# Altium schematic sheet BMS_BoardHardware_V1.SchDoc
size A4
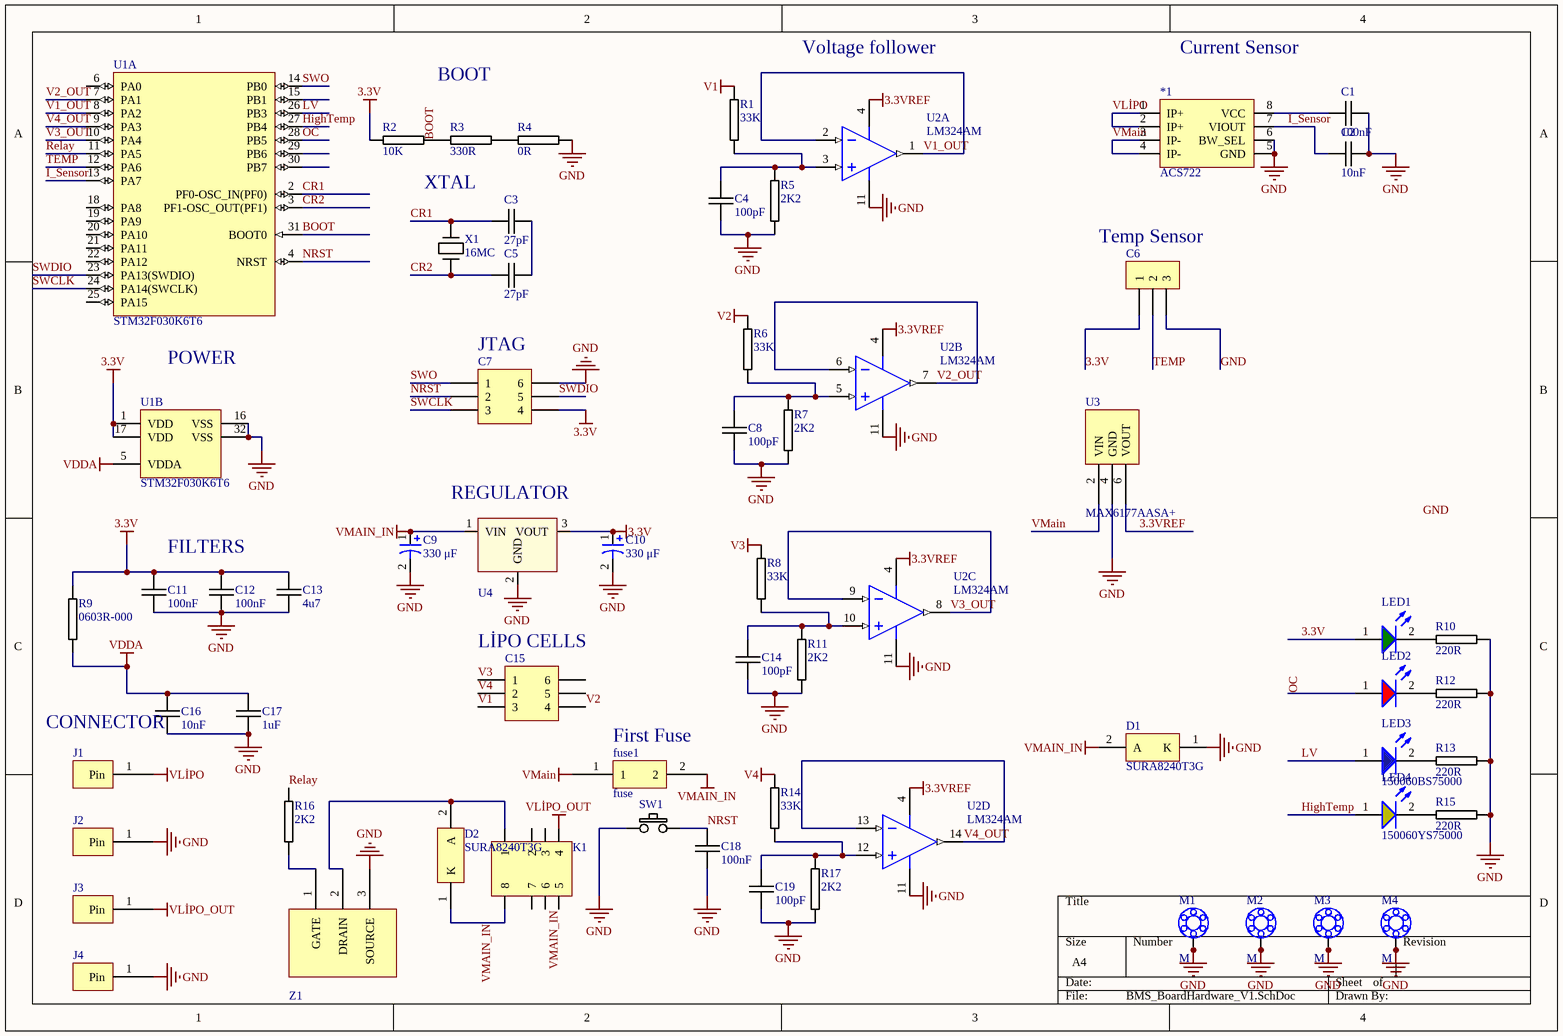
[diagram p0: BMS_BoardHardware_V1.SchDoc]

## Parts
*1  ACS722  [PCBComponent_1]
C1  100nF  [0603C-GENERIC]
C2  10nF  [0603C-GENERIC]
C3  27pF  [0603C-GENERIC]
C4  100pF  [0603C-GENERIC]
C5  27pF  [0603C-GENERIC]
C6  (no value)  [66200311122]
C7  (no value)  [66200621022]
C8  100pF  [0603C-GENERIC]
C9  330 μF  [WCAP-PSLP 6.3x5.8x2.2]
C10  330 μF  [WCAP-PSLP 6.3x5.8x2.2]
C11  100nF  [0603C-GENERIC]
C12  100nF  [0603C-GENERIC]
C13  4u7  [0603C-GENERIC]
C14  100pF  [0603C-GENERIC]
C15  (no value)  [66200621022]
C16  10nF  [0603C-GENERIC]
C17  1uF  [0603C-GENERIC]
C18  100nF  [0603C-GENERIC]
C19  100pF  [0603C-GENERIC]
D1  SURA8240T3G  [ONSC-SMA-2-403D-02_V]
D2  SURA8240T3G  [ONSC-SMA-2-403D-02_V]
fuse1  fuse  [fuse]
J1  (no value)  [74722015]
J2  (no value)  [74722015]
J3  (no value)  [74722015]
J4  (no value)  [74722015]
K1  (no value)  [RELAY]
LED1  (no value)  [LED_0603_Green]
LED2  (no value)  [LED_0603_Red]
LED3  150060BS75000  [LED_0603_Blue]
LED4  150060YS75000  [LED_0603_Yellow]
M1  M  [MOUNTING]  (no BOM)
M2  M  [MOUNTING]  (no BOM)
M3  M  [MOUNTING]  (no BOM)
M4  M  [MOUNTING]  (no BOM)
R1  33K  [0603R-33K]
R2  10K  [0603R-10K]
R3  330R  [0603R-330]
R4  0R  [0603R-0R]
R5  2K2  [0603R-2K2]
R6  33K  [0603R-33K]
R7  2K2  [0603R-2K2]
R8  33K  [0603R-33K]
R9  0603R-000  [0603R-GENERIC]
R10  220R  [0603R-220]
R11  2K2  [0603R-2K2]
R12  220R  [0603R-220]
R13  220R  [0603R-220]
R14  33K  [0603R-33K]
R15  220R  [0603R-220]
R16  2K2  [0603R-2K2]
R17  2K2  [0603R-2K2]
SW1  (no value)  [SW-PB-SMD]
U1  STM32F030K6T6  [STM-LQFP32_N]  (parts A,B of 2)
U2  LM324AM  [M14A_N]  (parts A,B,C,D of 4)
U3  MAX6177AASA+  [MAX6177AASA+]
U4  3.3V  [WE-FDSM]  (value not drawn)
X1  16MC  [XTAL-RU49/4]
Z1  Mosfet  [NXP-SOT89_A_M]  (value not drawn)

## Nets
3.3V: C6.1 C7.4 C10.1 C11.1 C12.1 C13.1 LED1.1(A) R2.1 R9.2 U1.1(VDD) U1.17(VDD) U4.3(VOUT)
3.3VREF: U2.4(V+) U3.6(VOUT)
GND: *1.5(GND) *1.6(BW_SEL) C1.2 C2.2 C4.2 C6.3 C7.6 C8.2 C9.2 C10.2 C11.2 C12.2 C13.2 C14.2 C16.2 C17.2 C18.2 C19.2 D1.1(K) J2.1(Pin) J4.1(Pin) M1.1 M1.2 M1.3 M1.4 M1.5 M1.6 M1.7 M2.1 M2.2 M2.3 M2.4 M2.5 M2.6 M2.7 M3.1 M3.2 M3.3 M3.4 M3.5 M3.6 M3.7 M4.1 M4.2 M4.3 M4.4 M4.5 M4.6 M4.7 R4.2 R5.1 R7.1 R10.2 R11.1 R12.2 R13.2 R15.2 R17.1 SW1.1 U1.16(VSS) U1.32(VSS) U2.11(GND) U3.4(GND) U4.2(GND) Z1.3(SOURCE)
V1: C15.3 R1.1
V2: C15.4 R6.1
V3: C15.1 R8.1
V4: C15.2 R14.1
VDDA: C16.1 C17.1 R9.1 U1.5(VDDA)
VLİPO: *1.1(IP+) *1.2(IP+) J1.1(Pin)
VLİPO_OUT: J3.1(Pin) K1.4
VMain: *1.3(IP-) *1.4(IP-) fuse1.1 U3.2(VIN)
VMAIN_IN: C9.1 D1.2(A) D2.1(K) fuse1.2 K1.6 K1.8 U4.1(VIN)
BOOT: R2.2 R3.1 U1.31(BOOT0)
CR1: C3.1 U1.2(PF0-OSC_IN(PF0)) X1.1
CR2: C5.1 U1.3(PF1-OSC_OUT(PF1)) X1.2
HighTemp: LED4.1(A) U1.27(PB4)
I_Sensor: *1.7(VIOUT) C2.1 U1.13(PA7)
LV: LED3.1(A) U1.26(PB3)
NRST: C7.2 C18.1 SW1.2 U1.4(NRST)
OC: LED2.1(A) U1.28(PB5)
Relay: R16.1 U1.11(PA5)
SWCLK: C7.3 U1.24(PA14(SWCLK))
SWDIO: C7.5 U1.23(PA13(SWDIO))
SWO: C7.1 U1.14(PB0)
TEMP: C6.2 U1.12(PA6)
V1_OUT: U1.8(PA2) U2.1(OUT1) U2.2(IN1-)
V2_OUT: U1.7(PA1) U2.6(IN2-) U2.7(OUT2)
V3_OUT: U1.10(PA4) U2.8(OUT3) U2.9(IN3-)
V4_OUT: U1.9(PA3) U2.13(IN4-) U2.14(OUT4)
Net*1_8: *1.8(VCC) C1.1
NetC3_2: C3.2 C5.2
NetC4_1: C4.1 R1.2 R5.2 U2.3(IN1+)
NetC8_1: C8.1 R6.2 R7.2 U2.5(IN2+)
NetC14_1: C14.1 R8.2 R11.2 U2.10(IN3+)
NetC19_1: C19.1 R14.2 R17.2 U2.12(IN4+)
NetD2_2: D2.2(A) K1.1 Z1.2(DRAIN)
NetLED1_2: LED1.2(C) R10.1
NetLED2_2: LED2.2(C) R12.1
NetLED3_2: LED3.2(C) R13.1
NetLED4_2: LED4.2(C) R15.1
NetR3_2: R3.2 R4.1
NetR16_2: R16.2 Z1.1(GATE)

Not connected (* = marked no-connect by the designer): C15 5 6; K1 2 3 5 7; U1 6(PA0) 15(PB1) 18(PA8) 19(PA9) 20(PA10) 21(PA11) 22(PA12) 25(PA15) 29(PB6) 30(PB7)

## Notes on the sheet
- BOOT
- Voltage follower
- Current Sensor
- XTAL
- (near C6) Temp Sensor
- (near U1) POWER
- (near C7) JTAG
- (near U4) REGULATOR
- FILTERS
- (near C15) LİPO CELLS
- CONNECTOR
- (near fuse1) First Fuse
- Labels drawn without touching a wire or pin: GND

## Library data of the parts
C1 C11 C12 = 0603C-100NF-25V-X7R-TDK: CAPACITOR 0603 CERAMIC; Manufacturer Part Number: C1608X7R1E104K; Manufacturer: TDK Corporation; Reel: C12; Supplier 1: Digi-Key; Supplier Part Number 1: 445-1316-2-ND
C2 C16 = 0603C-10NF-50V-X7R-MUR: CAPACITOR 0603 CERAMIC; Manufacturer Part Number: GRM188R71H103KA01D; Manufacturer: Murata Electronics North America; Reel: C22; Supplier 1: Digi-Key; Supplier Part Number 1: 490-1512-2-ND
C3 C5 = 0603C-27pF: CAPACITOR 0603 CERAMIC; REEL: C98; Supplier 1: Digi-Key; Supplier Part Number 1: 445-1274-2-ND
C4 C8 C14 C19 = 0603C-100PF-50V-NP0-AVX: CAPACITOR 0603 CERAMIC; Reel: C44
C6 = WE-3.00 mm Micro Power Connector 66200311122: WR-MPC3 3.00 mm Male Single Row Vertical Header; Manufacturer: W¨¹rth Elektronik eiSos GmbH; ComponentLink1 Description: Manufacturer; ComponentLink2 Description: Datasheet; NoPins: 03; Created Date: 27 August 2013; partNo: 66200311122; ComponentLink1URL: http://www.we-online.com; ComponentLink2URL: http://katalog.we-online.de/em/datasheet/6620xx11122.pdf; Created by: Karrer Zheng
C7 C15 = WE-3.00 mm Micro Power Connector 66200621022: WR-MPC3 3.00 mm Male Dual Row Angled Header with Plastic Pegs; Manufacturer: W¨¹rth Elektronik eiSos GmbH; ComponentLink1 Description: Manufacturer; ComponentLink2 Description: Datasheet; NoPins: 06; Created Date: 20 August 2013; partNo: 66200621022; ComponentLink1URL: http://www.we-online.com; ComponentLink2URL: http://katalog.we-online.de/em/datasheet/6620xx21022.pdf; Created by: Karrer Zheng
C9 C10 = WCAP-PSLP 6.3x5.8x2.2 875105144010: WCAP-PSLP Aluminum Polymer Capacitors , 330 μF; + / - 20%; 6,3 V , 6,3 x 5,8; Manufacturer: Wurth Elektronik; E-mail: libraries@we-online.com; Characteristics: Aluminum Polymer Capacitors;Recommended soldering: Reflow;Operating temperature: –55 °C to +105 °C;Low profile SMD product series;Low ESR at high frequency range;High permissible ripple current;Load life: 2000 h @ +105 °C; ComponentLink1Description: Manufacturer; ComponentLink1URL: http://www.we-online.com; ComponentLink2Description: Datasheet; ComponentLink2URL: http://katalog.we-online.de/pbs/datasheet/875105144010.pdf; Created by: Karrer Zheng; Created Date: 5/13/2015; Capacitance: 330 μF; Application: Low voltage port filtering, appplid to high-end switching power supply, PC(desktop,laptop ),industrial computer, VGA card, server power, charger, TV, digital set-top box,DC-DC power module, game machine etc which consume large current with high speed circuit.; partNo: 875105144010
C13 = 0603C-4U7-6V3-X5R-KEM: CAPACITOR 0603 CERAMIC; Reel: C36
C17 = 0603C-1UF-10V-X5R-TDK: CAPACITOR 0603 CERAMIC; Manufacturer: TDK Corporation; Manufacturer Part Number: C1608X5R1A105K; Reel: C23; Supplier 1: Digi-Key; Supplier Part Number 1: 445-1321-2-ND
C18 = 0603C-100NF-50V-X7R-TDK: CAPACITOR 0603 CERAMIC; Manufacturer Part Number: C1608X7R1H103K; Manufacturer: TDK Corporation; Temperature Coefficient: X7R; Tolerance: ±10%; Voltage - Rated: 50V; Capacitance: 10000pF; Reel: C68; RoHS: RoHS Compliant; Lead Spacing: -; Package / Case: 0603 (1608 metric); Features: General Purpose; Packaging: Tape & Reel (TR); Thickness: 0.80mm; Operating Temperature: -55°C ~ 125°C; Mounting Type: Surface Mount, MLCC; Category: Capacitors; Supplier 1: Digi-Key; Supplier Part Number 1: 445-1314-2-ND
D1 D2 = SURA8240T3G: Surface Mount Ultrafast Power Rectifier, 2-Pin SMA, Pb-Free, Tape and Reel; Manufacturer: On Semiconductor; IFSM Max (A): 35; DatasheetVersion: Rev. 4; PackageVersion: Rev. G, 07/2012; PackageReference: SMA-2-403D-02; PackageDescription: 2-Pin Small Molded Package, J-Bend Lead, Body 2.605 x 4.315 mm; Supplier 1: Digi-Key; Supplier Part Number 1: SURA8240T3G-ND; Supplier 2: Mouser; Supplier Part Number 2: 863-SURA8240T3G; Packing: Tape and Reel; RoHS: TRUE; Type: Ultrafast; Mounting Technology: Surface Mount; PartNumber: SURA8240T3G; ComponentLink1Description: Manufacturer URL; ComponentLink1URL: http://www.onsemi.com/; ComponentLink2Description: Datasheet; ComponentLink2URL: http://www.onsemi.cn/pub_link/Collateral/MURA230T3-D.PDF; ComponentLink3Description: Package Specification; ComponentLink3URL: http://www.onsemi.com/pub_link/Collateral/403D-02.PDF
J1-J4 = 74722015
K1 = G2RL-1A-12V
LED1 = WL-SMCW 0603  150060GS75000: SMD mono-color Chip LED, WL-SMCW, Green; Manufacturer: W黵th Elektronik eiSos GmbH; PartNo: 150060GS75000; ComponentLink1Description: Manufacturer; ComponentLink1URL: http://www.we-online.de; Created by: Christin Otto; Created Date: June 2013; ComponentLink2Description: Datasheet; ComponentLink2URL: http://katalog.we-online.com/led/datasheet/150060GS75000.pdf; Color: Green
LED2 = WL-SMCW 0603  150060RS75000: SMD mono-color Chip LED, WL-SMCW, Red; Manufacturer: W黵th Elektronik eiSos GmbH; PartNo: 150060RS75000; ComponentLink1Description: Manufacturer; ComponentLink1URL: http://www.we-online.de; Created by: Christin Otto; Created Date: June 2013; ComponentLink2Description: Datasheet; ComponentLink2URL: http://katalog.we-online.com/led/datasheet/150060RS75000.pdf; Color: Red
LED3 = WL-SMCW 0603  150060BS75000: SMD mono-color Chip LED, WL-SMCW, Blue; Manufacturer: W黵th Elektronik eiSos GmbH; PartNo: 150060BS75000; ComponentLink1Description: Manufacturer; ComponentLink1URL: http://www.we-online.de; Created by: Christin Otto; Created Date: June 2013; ComponentLink2Description: Datasheet; ComponentLink2URL: http://katalog.we-online.com/led/datasheet/150060BS75000.pdf; Color: Blue
LED4 = WL-SMCW 0603  150060YS75000: SMD mono-color Chip LED, WL-SMCW, Yellow; Manufacturer: W黵th Elektronik eiSos GmbH; PartNo: 150060YS75000; ComponentLink1Description: Manufacturer; ComponentLink1URL: http://www.we-online.de; Created by: Christin Otto; Created Date: June 2013; ComponentLink2Description: Datasheet; ComponentLink2URL: http://katalog.we-online.com/led/datasheet/150060YS75000.pdf; Color: Yellow
M1-M4 = MOUNTING: MOUNTING HOLE - NON INSTALLABLE
R1 R6 R8 R14 = 0603R-33K: GENERIC RESISTOR 0603; Manufacturer Part Number: RMC 1/16 33K 1% G; Manufacturer: Stackpole Electronics Inc; Temperature Coefficient: ±100ppm/°C; Resistance In Ohms: 33.0K; Tolerance: ±1%; Power (Watts): 0.1W, 1/10W; Supplier 1: Digi-Key; Supplier Part Number 1: RMC1/1633KFG-ND; Supplier Part Number: RMC1/1633KFG-ND; Lead Style: Surface Mount (SMD - SMT); Case: 0603 (1608 metric); RoHS: RoHS Compliant; Supplier: Digi-Key; Composition: Thick Film; Packaging: Tape & Reel (TR); Category: Resistors
R2 = 0603R-10K: GENERIC RESISTOR 0603; Manufacturer: Stackpole Electronics Inc; Manufacturer Part Number: RMCF 1/16 10K 1% R; Tolerance: ±1%; Power (Watts): 0.1W, 1/10W; Temperature Coefficient: ±100ppm/°C; Resistance In Ohms: 10.0K; Reel: R21; Category: Resistors; Supplier Part Number: RMCF1/1610KFRDKR-ND; Lead Style: Surface Mount (SMD - SMT); RoHS: RoHS Compliant; Packaging: Digi-Reel®; Case: 0603 (1608 metric); Composition: Thick Film; Supplier: Digi-Key; Supplier 1: Digi-Key; Supplier Part Number 1: RMCF0603FT10K0DKR-ND
R3 = 0603R-330: GENERIC RESISTOR 0603; Manufacturer Part Number: RMCF 1/16 330 1% R; Manufacturer: Stackpole Electronics Inc; Power (Watts): 0.1W, 1/10W; Tolerance: ±1%; Resistance In Ohms: 330; Temperature Coefficient: ±100ppm/°C; Supplier 1: Digi-Key; Supplier Part Number 1: RMCF1/16330FRCT-ND; RoHS: RoHS Compliant; Packaging: Cut Tape (CT); Supplier: Digi-Key; Case: 0603 (1608 metric); Lead Style: Surface Mount (SMD - SMT); Supplier Part Number: RMCF1/16330FRCT-ND; Composition: Thick Film; Category: Resistors
R4 = 0603R-0R: GENERIC JUMPER 0603; Manufacturer: Stackpole Electronics Inc; Manufacturer Part Number: RMC 1/16 0 G; Reel: R26; Supplier 1: Digi-Key; Supplier Part Number 1: RMCF0603ZT0R00TR-ND
R5 R7 R11 R16 R17 = 0603R-2K2: GENERIC RESISTOR 0603; Manufacturer Part Number: RMC 1/16 2.2K 1% R; Manufacturer: Stackpole Electronics Inc; REEL: R88; Supplier 1: Digi-Key; Supplier Part Number 1: RMCF0603FT2K20TR-ND
R9 = 0603R-000: GENERIC RESISTOR 0603
R10 R12 R13 R15 = 0603R-220: GENERIC RESISTOR 0603; Manufacturer: Stackpole Electronics Inc; Manufacturer Part Number: RMCF 1/16 220 1% R; Resistance In Ohms: 220; Power (Watts): 0.1W, 1/10W; Tolerance: ±1%; Temperature Coefficient: ±100ppm/°C; Supplier 1: Digi-Key; Supplier Part Number 1: RMCF1/16220FRCT-ND; Lead Style: Surface Mount (SMD - SMT); Case: 0603 (1608 metric); RoHS: RoHS Compliant; Supplier: Digi-Key; Packaging: Cut Tape (CT); Composition: Thick Film; Supplier Part Number: RMCF1/16220FRCT-ND; Category: Resistors
SW1 = SW-PB-BLACK-SMD: PUSHBUTTON SWITCH 6MM SMD
U1 = STM32F030K6T6: ARM Cortex-M0 32-bit MCU, 32 KB Flash, 4 KB Internal RAM, 26 I/Os, 32-pin LQFP, -40 to 85 degC, Tray; FLASH Size (Prog) (kB): 32; I/Os (High Current): 26; Internal RAM Size (kB): 4; Operating Frequency(F) (Processor speed) (MHz): 48; Supply Voltage(Vcc) min (V): 2.4; DatasheetVersion: Rev. 1; PackageVersion: Rev. 1, 07/2013; PackageReference: LQFP32; PackageDescription: 32-Pin Low Profile Quad Flat Package, 7 x 7 mm Body, 0.8 mm Pitch; Supplier 1: Digi-Key; Supplier Part Number 1: 497-14046-ND; Supplier 2: Newark; Supplier Part Number 2: 19X6194; Supplier 3: Mouser; Supplier Part Number 3: 511-STM32F030K6T6; Core: ARM Cortex-M0; Packing: Tray; Mounting Technology: Surface Mount; PartNumber: STM32F030K6T6; ComponentLink1Description: Manufacturer URL; ComponentLink1URL: http://www.st.com/web/en/home.html; ComponentLink2Description: Datasheet; ComponentLink2URL: http://www.st.com/st-web-ui/static/active/en/resource/technical/document/datasheet/DM00088500.pdf; ComponentLink3Description: Package Specification; ComponentLink3URL: http://www.st.com/st-web-ui/static/active/en/resource/technical/document/datasheet/DM00088500.pdf
U2 = LM324AM: Low Power Quad Operational Amplifier, 14-pin Narrow SOIC; Manufacturer: National Semiconductor; PackageTopMarking: NSUZXYTTE#*LM324AM; PowerWise: N; CompType: Amplifiers; High-Reliability: Y; DatasheetVersion: Aug-2000; PackageVersion: revJ, Jan-1996; PackageReference: M14A; PackageDescription: Molded Package S.O., .150in Wide, 14 Lead; PartNumber: LM324AM; RoHS: N; PinCount: 14; Code_JEDEC: MS-012AB; Code_IPC: SOIC127P600-14; ComponentLink1Description: Manufacturer URL; ComponentLink1URL: http://www.national.com/; ComponentLink2Description: LM324 Datasheet; ComponentLink2URL: http://www.national.com/ds/LM/LM324.pdf; ComponentLink3Description: LM324 Web Page; ComponentLink3URL: http://www.national.com/pf/LM/LM324.html; ComponentLink4Description: M14A Package Page; ComponentLink4URL: http://www.national.com/packaging/folders/m14a.html
U4 = WE-FDSM , 173950378: MagI³C-FDSM Fixed Step Down Regulator Module WE-FDSM , Vin=6V-28V; Manufacturer: Würth Elektronik eiSos GmbH; Input Voltage (Vin): 6V-28V; Output Current (Iout): 500mA; PartNo: 173950378; ComponentLink1Description: Manufacturer; ComponentLink1URL: http://www.we-online.de; Created by: Otto Christin; Created Date: NOV 2014; ComponentLink2Description: Datasheet; ComponentLink2URL: http://www.we-online.de/katalog/media/pdf/173950378.pdf; Output Voltage (Vout): 3.3V; Package: SIP-3
X1 = 16MC-HC49US: 16MHZ CRSYTAL HC49US; Supplier 1: Mouser; Supplier Part Number 1: 815-ABLS-16.0M-T
Z1 = Z